# Altium schematic sheet TUSB8041_Power_Logic_2.SchDoc
size A4; SheetNumber: 3; SheetTotal: 3
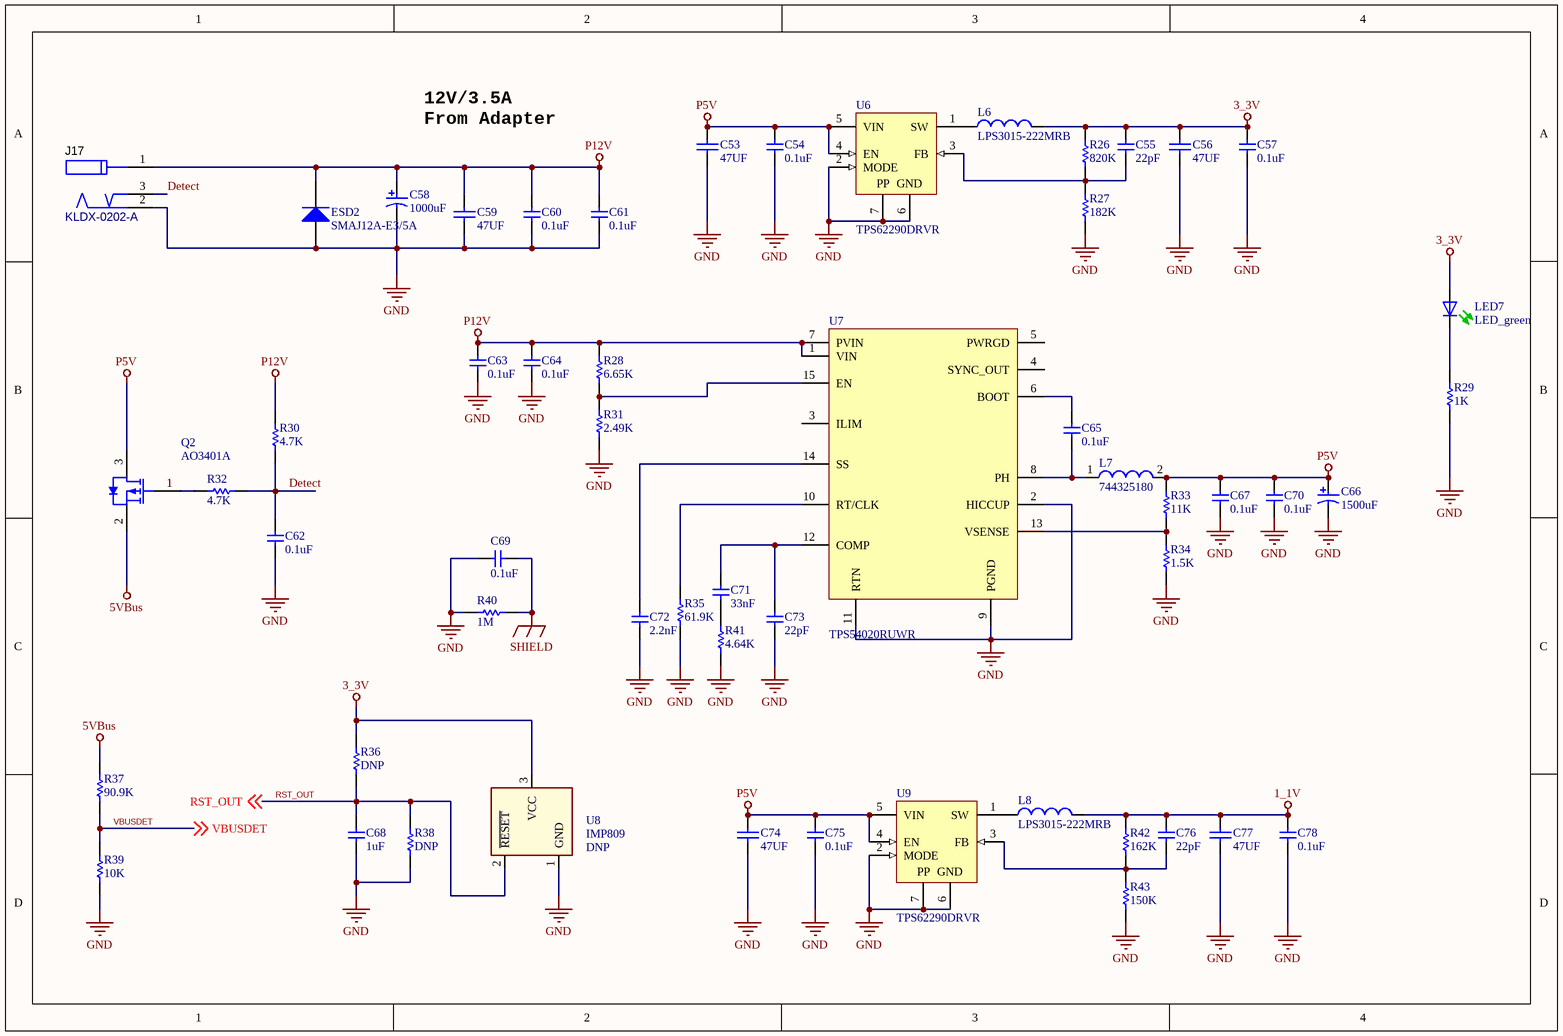
[diagram p0: TUSB8041_Power_Logic_2.SchDoc]

## Parts
C53  47UF  [CAPC1210(3225)200_L]
C54  0.1uF  [CAP0603]
C55  22pF  [CAP0603]
C56  47UF  [CAPC1210(3225)200_L]
C57  0.1uF  [CAP0603]
C58  1000uF  [NIC-UVR-10x12.5-2_V]
C59  47UF  [CAPC1210(3225)200_L]
C60  0.1uF  [CAP0603]
C61  0.1uF  [CAP0603]
C62  0.1uF  [CAP0603]
C63  0.1uF  [CAP0805]
C64  0.1uF  [CAP0603]
C65  0.1uF  [CAP0603]
C66  1500uF  [NIC-UVR-10x12.5-2_V]
C67  0.1uF  [CAP0805]
C68  1uF  [CAP0603]
C69  0.1uF  [CAP0603]
C70  0.1uF  [CAP0603]
C71  33nF  [CAP0603]
C72  2.2nF  [CAP0603]
C73  22pF  [CAP0603]
C74  47UF  [CAPC1210(3225)200_L]
C75  0.1uF  [CAP0603]
C76  22pF  [CAP0603]
C77  47UF  [CAPC1210(3225)200_L]
C78  0.1uF  [CAP0603]
ESD2  SMAJ12A-E3/5A  [VISH-DO-214AC-2_M]
J17  KLDX-0202-A  [KYCN-KLDX-0202-A_V]
L6  LPS3015-222MRB  [COIL-LPS3015_V]
L7  744325180  [WE-HCI-1050]
L8  LPS3015-222MRB  [COIL-LPS3015_V]
LED7  LED_green  [LED-0603-GREEN]
Q2  AO3401A  [AO-SOT-23-3L_V]
R26  820K  [RES0603]
R27  182K  [RES0603]
R28  6.65K  [RES0603]
R29  1K  [RES0603]
R30  4.7K  [RES0603]
R31  2.49K  [RES0603]
R32  4.7K  [RES0603]
R33  11K  [RES0603]
R34  1.5K  [RES0603]
R35  61.9K  [RES0603]
R36  DNP  [RES0603]
R37  90.9K  [RES0603]
R38  DNP  [RES0603]
R39  10K  [RES0603]
R40  1M  [RES0805]
R41  4.64K  [RES0603]
R42  162K  [RES0603]
R43  150K  [RES0603]
U6  TPS62290DRVR  [DRV6-1600X1000TP]
U7  TPS54020RUWR  [R-PVQFN-N15]
U8  IMP809  Parameter 1: DNP  [SOT23]
U9  TPS62290DRVR  [DRV6-1600X1000TP]

## Nets
1_1V: C76.2 C77.2 C78.2 L8.2 R42.1
3_3V: C55.2 C56.2 C57.2 L6.2 LED7.A R26.1 R36.1 U8.3(VCC)
5VBus: Q2.2(SOURCE) R37.1
GND: C53.1 C54.1 C56.1 C57.1 C58.2 C59.1 C60.1 C61.1 C62.1 C63.1 C64.1 C66.2 C67.1 C68.1 C69.2 C70.1 C72.1 C73.1 C74.1 C75.1 C77.1 C78.1 ESD2.2(A) J17.2 R27.2 R29.1 R31.2 R34.2 R35.2 R38.2 R39.2 R40.1 R41.2 R43.2 U6.2(MODE) U6.6(GND) U6.7(PP) U7.2(HICCUP) U7.9(PGND) U7.11(RTN) U8.1(GND) U9.2(MODE) U9.6(GND) U9.7(PP)
P5V: C53.2 C54.2 C66.1 C67.2 C70.2 C74.2 C75.2 L7.2 Q2.3(DRAIN) R33.1 U6.4(EN) U6.5(VIN) U9.4(EN) U9.5(VIN)
P12V: C58.1 C59.2 C60.2 C61.2 C63.2 C64.2 ESD2.1(K) J17.1 R28.1 R30.1 U7.1(VIN) U7.7(PVIN)
SHIELD: C69.1 R40.2
Detect: C62.2 J17.3 R30.2 R32.2
RST_OUT: C68.2 R36.2 R38.1 U8.2(~{RESET}) ; off-sheet RST_OUT
VBUSDET: R37.2 R39.1 ; off-sheet VBUSDET
NetC55_1: C55.1 R26.2 R27.1 U6.3(FB)
NetC65_1: C65.1 L7.1 U7.8(PH)
NetC65_2: C65.2 U7.6(BOOT)
NetC71_1: C71.1 R41.1
NetC71_2: C71.2 C73.2 U7.12(COMP)
NetC72_2: C72.2 U7.14(SS)
NetC76_1: C76.1 R42.2 R43.1 U9.3(FB)
NetL6_1: L6.1 U6.1(SW)
NetL8_1: L8.1 U9.1(SW)
NetLED7_K: LED7.K(C) R29.2
NetQ2_1: Q2.1(GATE) R32.1
NetR28_2: R28.2 R31.1 U7.15(EN)
NetR33_2: R33.2 R34.1 U7.13(VSENSE)
NetR35_1: R35.1 U7.10(RT/CLK)

Not connected (* = marked no-connect by the designer): U7 3(ILIM) 4(SYNC_OUT) 5(PWRGD)

## Notes on the sheet
- 12V/3.5A
  From Adapter

## Library data of the parts
C53 C56 C59 C74 C77 = CAP_5_2: 1210 (3225 Metric) Chip Capacitor; Case-EIA: 1210; Case-Metric: 3225; PackageReference: CAPC1210(3225)200
C54 C55 C57 C60-C65 C67-C73 C75 C76 C78 = CAP: Capacitor; Value: 104; Published: 8-Jun-2000; LatestRevisionDate: 17-Jul-2002; LatestRevisionNote: Re-released for DXP Platform.; PackageReference: RAD-0.3; Publisher: Altium Limited
C58 = CMP-1217-00001-1: Aluminum Electrolytic Capacitor, 63 V, -40 to 85 degC, 2-Pin CAP, RoHS; Manufacturer: Nichicon; PartNumber: UVR1J101MPD1TD; Capacitance Tolerance: +/-20%; Rated Voltage: 63 V; Packing: Bulk; Rated Ripple@85 degC 120 Hz: 300 mA; Rated Capacitance: 100 uF; ComponentLink3URL: http://nichicon-us.com/english/products/pdfs/e-vr.pdf; ComponentLink2Description: Datasheet; Operating Temperature: -40 to 85 degC; PackageDescription: 2-Pin Through Hole Package, Dia 10 mm, Body Length 12.5 mm, Pitch 5 mm; Mounting Technology: Through Hole; ComponentLink3Description: Package Specification; RoHS: TRUE; DatasheetVersion: Sep-13; ComponentLink1Description: Manufacturer URL; ComponentLink2URL: http://nichicon-us.com/english/products/pdfs/e-vr.pdf; ComponentLink1URL: http://www.nichicon.co.jp/
C66 = CMP-1217-00001-1: Aluminum Electrolytic Capacitor, 6.3 V, -40 to 85 degC, 2-Pin CAP, RoHS; Manufacturer: Nichicon; PartNumber: UVR1J101MPD1TD; Capacitance Tolerance: +/-20%; Rated Voltage: 63 V; Packing: Bulk; Rated Ripple@85 degC 120 Hz: 300 mA; Rated Capacitance: 100 uF; ComponentLink3URL: http://nichicon-us.com/english/products/pdfs/e-vr.pdf; ComponentLink2Description: Datasheet; Operating Temperature: -40 to 85 degC; PackageDescription: 2-Pin Through Hole Package, Dia 10 mm, Body Length 12.5 mm, Pitch 5 mm; Mounting Technology: Through Hole; ComponentLink3Description: Package Specification; RoHS: TRUE; DatasheetVersion: Sep-13; ComponentLink1Description: Manufacturer URL; ComponentLink2URL: http://nichicon-us.com/english/products/pdfs/e-vr.pdf; ComponentLink1URL: http://www.nichicon.co.jp/
ESD2 = CMP-0548-00315-2: Transient Voltage Suppressor, 6.40 to 231 V, 12 V Stand-off Voltage, Uni-Directional, -55 to 155 degC, 2-pin DO-214AC, Pb-Free, Tape and Reel; Manufacturer: Vishay Semiconductor; IFSM: 40 A; ID (uA): 1; VBR Uni-Directional (V): 6.4 to 231; PPPM (W): 400, 300; VWM (V): 12; PartNumber: SMAJ12A-E3/5A; ComponentLink2URL: http://www.vishay.com/docs/88390/smaj50a.pdf; Packing: Tape and Reel; DatasheetVersion: 12/8/2013; Operating Junction and Storage Temperature Range: -55 to 150 degC; Mounting Technology: Surface Mount; PackageDescription: 2-Pin DO-214AC (SMA), Body 4.245 x 2.665 mm; ComponentLink1URL: http://www.vishay.com/; ComponentLink3Description: Package Specification; PackageReference: DO-214AC-2; ComponentLink1Description: Manufacturer URL; ComponentLink2Description: Datasheet; RoHS: TRUE; ComponentLink3URL: http://www.vishay.com/docs/88390/smaj50a.pdf
J17 = CMP-1673-00001-1: DC Power Connectors 2mm PCB JACK POWER JACK; ComponentLink1URL: http://www.mouser.com/ds/2/222/KLDX_0202_LT-334784.pdf; ComponentLink1Description: Datasheet; PackageReference: KLDX-0202-A; PartNumber: KLDX-0202-A
L6 L8 = CMP-2000-06574-1: Shielded Power Inductor, 2.2 uH, +/- 20%, 110 mOhm, -40 to 85 degC, 2-Pin SMD, RoHS, Tape and Reel; Core Material: Ferrite; Qualification: AEC-Q200; Unit Weight: 0.001411oz; Maximum DC Resistance: 110mOhms; Maximum DC Current: 2.1A; Brand: Coilcraft; Test Frequency: 100kHz; Self Resonant Frequency: 110MHz; Inductance: 2.2uH; Width: 3mm; Datasheet URL: http://www.coilcraft.com/pdfs/lps3015.pdf; Series: LPS3015; Termination Style: SMD/SMT; Length: 3mm; Height: 1.4mm; Manufacturer: Coilcraft; Type: ShieldedPowerInductor; Package Reference: LPS3015; Mounting Style: SMD/SMT; RoHS: True; Tolerance: 20%; Product Category: FixedInductors; Datasheet Version: 09/2015; Manufacturer URL: http://www.coilcraft.com/; Packaging: CutTape; Operating Temperature Range: -40Cto+85C; Factory Pack Quantity: 1; Mounting Technology: SurfaceMount; Product: PowerInductors; Package Description: 2-Pin Surfave Mount Device, Body 2.95 x 2.95 mm; Shielding: Shielded
L7 = CMP-0226-00134-1: SMD Flat Wire High Current Inductor WE-HCI, L=1.80 µH; Inductance: 1.80 ÂµH; PackageVersion: 2008; ComponentLink1Description: Manufacturer Link; PackageReference: WE-HCI-1050; ComponentLink1URL: http://www.we-online.com; ComponentLink2URL: http://www.we-online.de/katalog/media/pdf/744325180.pdf; DatasheetVersion: ver 2, Jan-2008; PackageDescription: SMD Inductor, 2-Leads, Body 10.5 x 10.2 mm; ComponentLink2Description: Datasheet
Q2 = CMP-2000-05778-1: P-Channel MOSFET, 30 V, 4 A, -55 to 150 degC, 3-Pin SOT-23-3L, RoHS, Tape and Reel; Manufacturer: Alpha and Omega; Output Power (Max): NotRequiredW; Power Dissipation: 1.4W; Rad Hardened: No; Drain Efficiency: NotRequired%; Drain-Source On-Volt: 30V; Noise Figure: NotRequireddB; Frequency (Max): NotRequiredMHz; Number of  Elements: 1; Gate-Source Voltage (Max): ?12V; Drain Current (Max): 4A; Channel Mode: Enhancement; Drain-Source On-Res: 0.044ohm; Type: PowerMOSFET; Polarity: P; Package URL: http://www.aosmd.com/res/packaging_information/SOT-23-3L.pdf; Datasheet URL: http://www.aosmd.com/res/data_sheets/AO3401A.pdf; Package Type: SOT-23; Package Description: 3-Pin Small Outline Transistor, Body 2.95 x 1.6 mm, Pitch 0.95 mm; Mounting: SurfaceMount; Manufacturer URL: http://www.aosmd.com/; Continuous Drain Current: 4A; Package Reference: SOT-23-3L; Mounting Technology: SurfaceMount; Operating Temperature Classification: Military; Power Gain: NotRequireddB; Datasheet Version: Rev. 3, 03/2011; Operating Temp Range: -55Cto150C; Pin Count: 3
R26-R28 R30-R43 = RES: Resistor; Value: 1K; Published: 8-Jun-2000; Revision: July-2002: Re-released for DXP Platform.; Publisher: Altium Limited
R29 = RES: Resistor; Published: 8-Jun-2000; Revision: July-2002: Re-released for DXP Platform.; Publisher: Altium Limited; Value: 1K
U6 U9 = CMP-0323-00361-1: Buck Step Down Regulator with 2.3 to 6 V Input and 0.6 to 6 V Output, -40 to 85 degC, 6-Pin SON (DRV), Green (RoHS & no Sb/Br); Manufacturer: Texas Instruments; Iout(Max)(A): 1; Vout(Min)(V): 0.6; Synchronous Rectification: TRUE; Rating: Catalog; Vin(Max)(V): 6; Duty Cycle(Max)(%): 100; Switch Current Limit(Typ)(A): 1.4; Vin(Min)(V): 2.3; SubFamily: Step-Down Regulator; Iq(Typ)(mA): 0.015; ComponentLink1URL: http://www.ti.com/general/docs/lit/getliterature.tsp?genericPartNumber=TPS62290&fileType=pdf; Topology: Buck; PackageVersion: revE, Oct-2010; Eco-Plan: Green (RoHS & no Sb/Br); Mounting Technology: Surface Mount; PartNumber: TPS62290DRVR; Regulated Outputs(#): 1; Vout(Max)(V): 6; ComponentLink2URL: Samples URL:http://www.ti.com/product/tps62290#samples; DatasheetVersion: SLVS764C; ComponentLink1Description: Datasheet; PackageReference: DRV6-1600X1000TP; PackageDescription: 6-Pin Plastic Small Outline No-Lead, 2 x 2 x 0.8 mm Body, 0.65 mm Pitch, Exposed Pad; ComponentLink2Description: URL Link1
U7 = TPS54020RUWR: Manufacturer Name: Texas Instruments; Manufacturer Part Number: TPS54020RUWR; Value: N/A; PackageReference: TPS54020RUWR
U8 = IMP809: Power Monitor